# EAGLE schematic PLEN2_EdisonBoard (EAGLE 6.5.0)
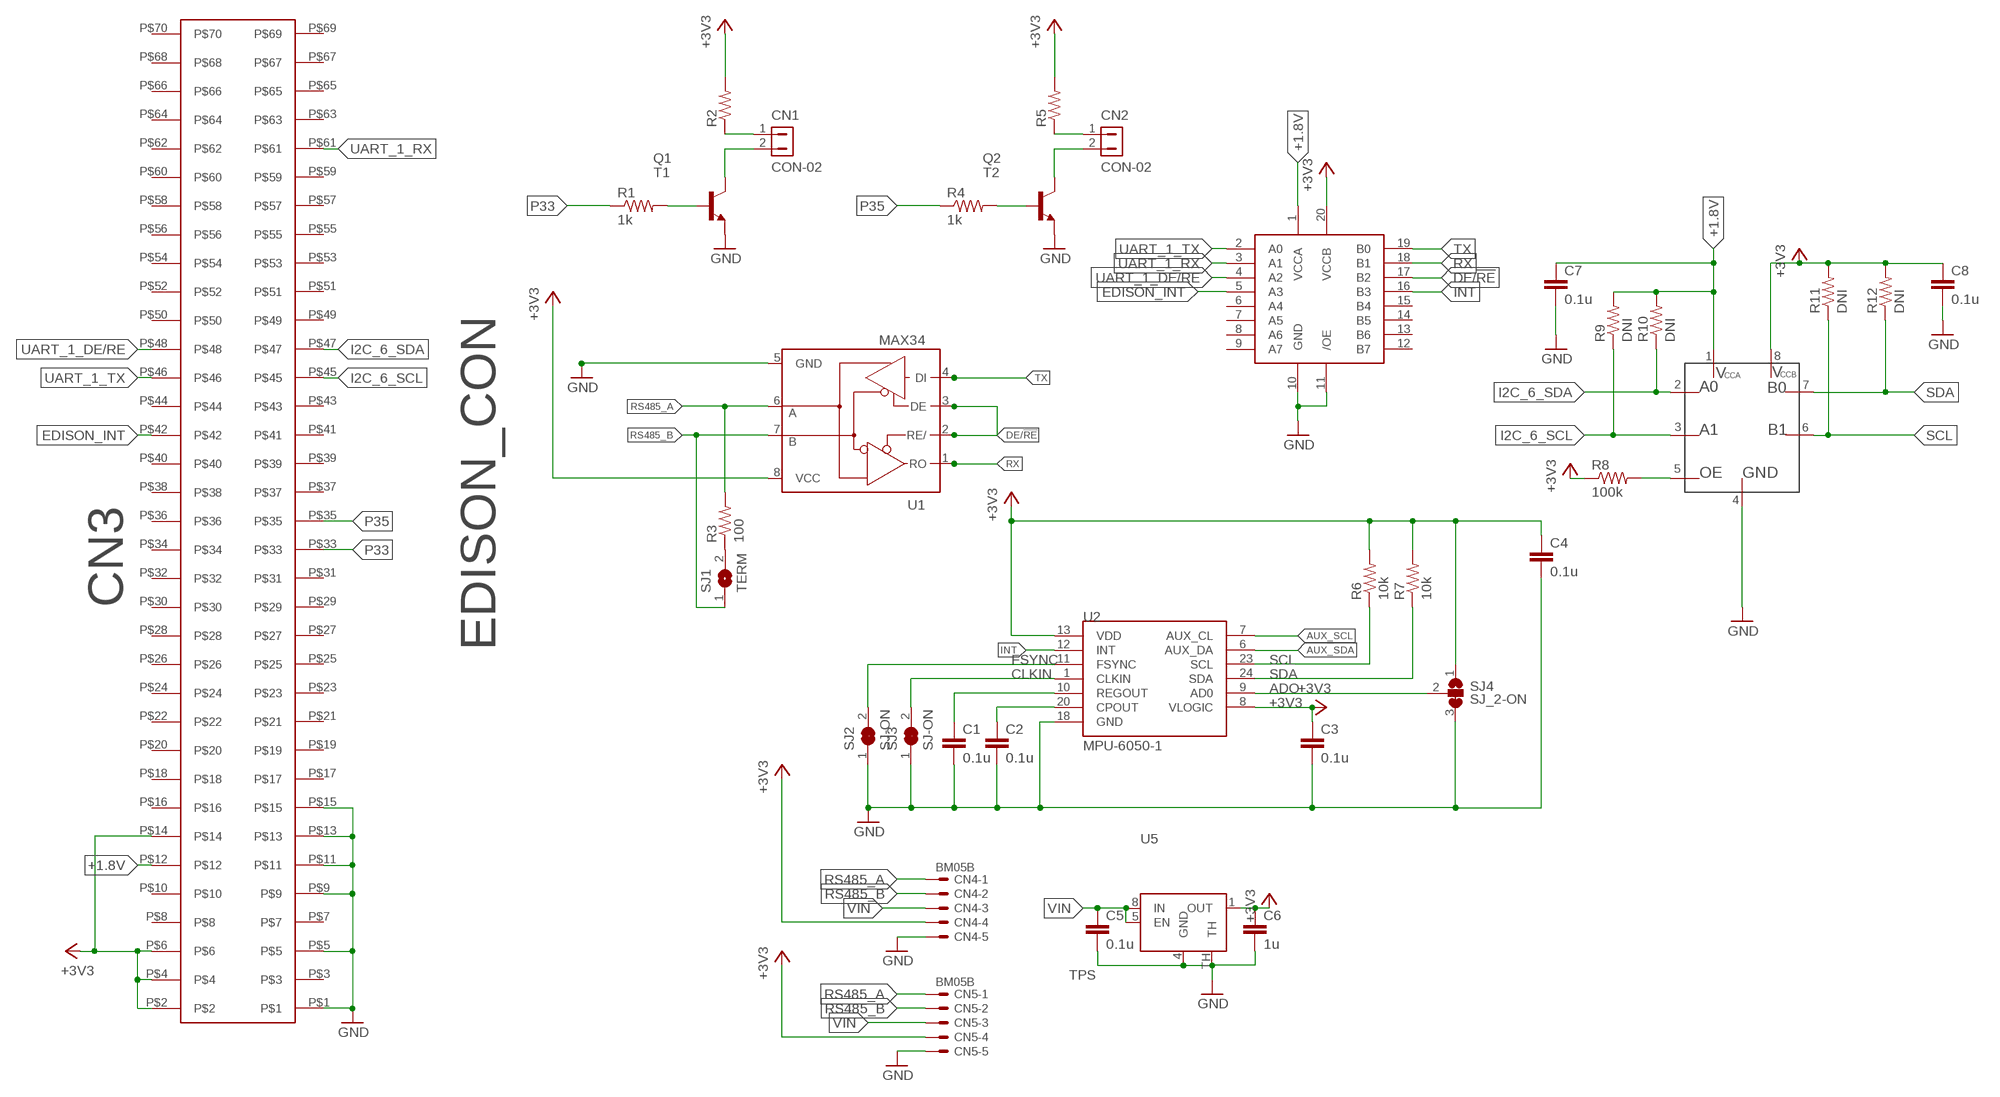
[diagram p0: schematic, sheet 1]

## Parts
C1  0.1u  C-EUC0603  [C0603]
C2  0.1u  C-EUC0603  [C0603]
C3  0.1u  C-EUC0603  [C0603]
C4  0.1u  C-EUC0603  [C0603]
C5  0.1u  C-EUC0603  [C0603]
C6  1u  C-EUC0603  [C0603]
C7  0.1u  C-EUC0603  [C0603]
C8  0.1u  C-EUC0603  [C0603]
CN1  CON-02  [SIP-100-02]
CN2  CON-02  [SIP-100-02]
CN3  EDISON_CON  [EDISON_CON]
CN4  BM05B  BM05B-SRSS-TB  [BM05B-SRSS-TB]
CN5  BM05B  BM05B-SRSS-TB  [BM05B-SRSS-TB]
Q1  T1  BC817-40LT1SMD  [SOT23-BEC]
Q2  T2  BC817-40LT1SMD  [SOT23-BEC]
R1  1k  R-US_R0603  [R0603]
R2  R-US_R0603  [R0603]
R3  100  R-US_R0603  [R0603]
R4  1k  R-US_R0603  [R0603]
R5  R-US_R0603  [R0603]
R6  10k  R-US_R0603  [R0603]
R7  10k  R-US_R0603  [R0603]
R8  100k  R-US_R0603  [R0603]
R9  DNI  R-US_R0603  [R0603]
R10  DNI  R-US_R0603  [R0603]
R11  DNI  R-US_R0603  [R0603]
R12  DNI  R-US_R0603  [R0603]
SJ1  TERM  SJ  [SJ]
SJ2  SJ-ON  [SJ-ON]
SJ3  SJ-ON  [SJ-ON]
SJ4  SJ_2-ON  [SJ_2-ON]
U1  MAX34  MAX34SHORT  [SO08SHORT]
U2  MPU-6050-1  [QFN-24-4MM2]
U3  FXMA108FXMA108  [FXMA108]
U5  TPS  TPS73733  [S-PVSON-N8]
U$2  FXMA2102_MAC08A  [FXMA2102_MAC08A]

## Nets
+1.8V: C7.1 CN3.P$12 R9.2 R10.2 U3.1(VCCA) U$2.PIN1(P1)
+3V3: C3.1 C4.1 C6.1 C8.1 CN3.P$2 CN3.P$4 CN3.P$6 CN3.P$14 CN4.4 CN5.4 R2.2 R5.2 R6.2 R7.2 R8.1 R11.2 R12.2 SJ4.1 U1.8(VCC) U2.8(VLOGIC) U2.13(VDD) U3.20(VCCB) U5.1(OUT) U$2.PIN8(P8)
ADO: SJ4.2 U2.9(AD0)
AUX_SCL: U2.7(AUX_CL)
AUX_SDA: U2.6(AUX_DA)
CLKIN: SJ3.2 U2.1(CLKIN)
DE/!RE: U1.2(RE/) U1.3(DE) U3.17(B2)
EDISON_INT: CN3.P$42 U3.5(A3)
FSYNC: SJ2.2 U2.11(FSYNC)
GND: C1.2 C2.2 C3.2 C4.2 C5.2 C6.2 C7.2 C8.2 CN3.P$1 CN3.P$5 CN3.P$9 CN3.P$11 CN3.P$13 CN3.P$15 CN4.5 CN5.5 Q1.E Q2.E SJ2.1 SJ3.1 SJ4.3 U1.5(GND) U2.18(GND) U3.10(GND) U3.11(/OE) U5.4(GND) U5.TH U$2.PIN4(P4)
I2C_6_SCL: CN3.P$45 R9.1 U$2.PIN3(P3)
I2C_6_SDA: CN3.P$47 R10.1 U$2.PIN2(P2)
INT: U2.12(INT) U3.16(B3)
N$1: R8.2 U$2.PIN5(P5)
N$76: C2.1 U2.20(CPOUT)
N$77: C1.1 U2.10(REGOUT)
N$78: Q1.B R1.2
N$79: CN1.2 Q1.C
N$80: CN1.1 R2.1
N$81: Q2.B R4.2
N$82: CN2.2 Q2.C
N$83: CN2.1 R5.1
N$85: R3.1 SJ1.2
P33: CN3.P$33 R1.1
P35: CN3.P$35 R4.1
RS485_A: CN4.1 CN5.1 R3.2 U1.6(A)
RS485_B: CN4.2 CN5.2 SJ1.1 U1.7(B)
RX: U1.1(RO) U3.18(B1)
SCL: R6.1 R11.1 U2.23(SCL) U$2.PIN6(P6)
SDA: R7.1 R12.1 U2.24(SDA) U$2.PIN7(P7)
TX: U1.4(DI) U3.19(B0)
UART_1_DE/RE: CN3.P$48 U3.4(A2)
UART_1_RX: CN3.P$61 U3.3(A1)
UART_1_TX: CN3.P$46 U3.2(A0)
VIN: C5.1 CN4.3 CN5.3 U5.5(EN) U5.8(IN)
Unconnected: CN3.P$3 CN3.P$7 CN3.P$8 CN3.P$10 CN3.P$16 CN3.P$17 CN3.P$18 CN3.P$19 CN3.P$20 CN3.P$21 CN3.P$22 CN3.P$23 CN3.P$24 CN3.P$25 CN3.P$26 CN3.P$27 CN3.P$28 CN3.P$29 CN3.P$30 CN3.P$31 CN3.P$32 CN3.P$34 CN3.P$36 CN3.P$37 CN3.P$38 CN3.P$39 CN3.P$40 CN3.P$41 CN3.P$43 CN3.P$44 CN3.P$49 CN3.P$50 CN3.P$51 CN3.P$52 CN3.P$53 CN3.P$54 CN3.P$55 CN3.P$56 CN3.P$57 CN3.P$58 CN3.P$59 CN3.P$60 CN3.P$62 CN3.P$63 CN3.P$64 CN3.P$65 CN3.P$66 CN3.P$67 CN3.P$68 CN3.P$69 CN3.P$70 U3.6(A4) U3.7(A5) U3.8(A6) U3.9(A7) U3.12(B7) U3.13(B6) U3.14(B5) U3.15(B4)

## Library data of the parts
C1-C8 = rcl:C-EU: CAPACITOR, European symbol
CN1 CN2 = con-headers-jp:CON-02
CN3 = edison:EDISON_CON
CN4 CN5 = con-jst2:?M05B-SRSS-TB: Disconnectable Crimp style connector, 1.0mm pitch 5 contacts
Q1 Q2 = transistor-npn:BC817*: NPN Transistor
R1-R12 = rcl:R-US_: RESISTOR, American symbol
SJ1 = jumper:SJ: SMD solder JUMPER
SJ2 SJ3 = jumper:SJ-ON
SJ4 = jumper:SJ_2-ON
U1 = maxim:MAX34*: +5V, Fail-Safe, 40Mbps, Profibus RS-485/RS-422 Transceivers Source: MAX3465-MAX3469.pdf
U2 = Testing:MPU-6050
U3 = FXMA108:FXMA108: FXMA108 voltage-level-translators
U5 = ti-regulator:TPS73733
U$2 = FXMA2102_MAC08A:FXMA2102_MAC08A

## Net classes
1 power: width 0.254 mm, drill 0.33 mm, clearance 0.152 mm